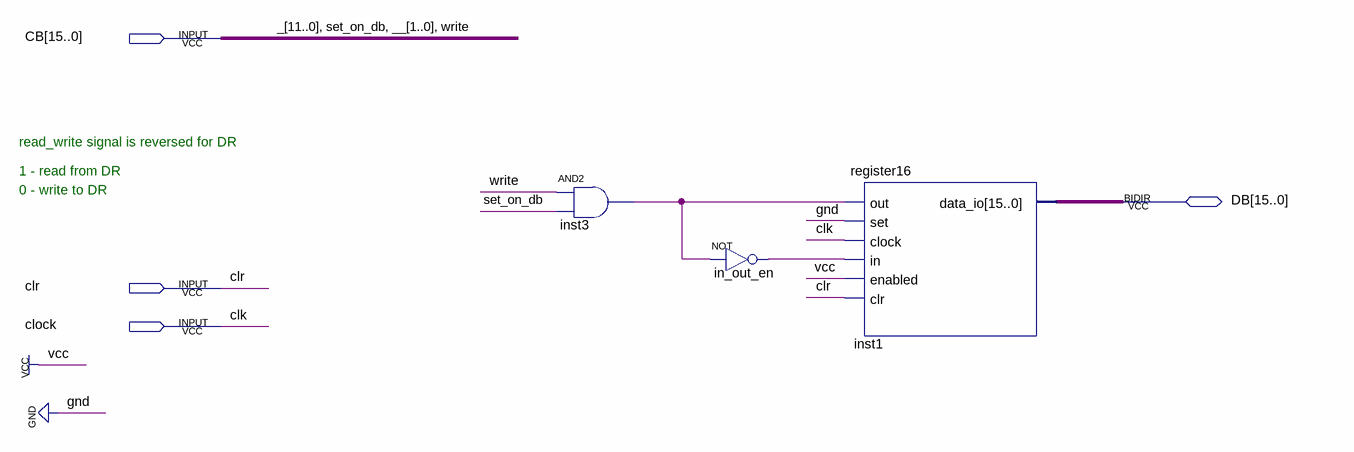
[diagram p0: schematic sheet]
// Quartus schematic data_register.bdf as structural Verilog: 3 symbols, 4 pins
module data_register (
  input  [15:0] CB,
  input  clr,
  input  clock,
  inout  [15:0] DB
);

  wire in_out_en_out, inst3_out;

  and inst3 (inst3_out, CB[0], CB[3]);
  not in_out_en (in_out_en_out, inst3_out);
  register16 inst1 (
    .out(inst3_out), .set(1'b0), .clock(clock), .in(in_out_en_out), .enabled(1'b1), .clr(clr), .data_io(DB));

  // Other names for the same wires on the sheet: _[11:0] = CB[15:4]; __[1:0] = CB[2:1]; clk = clock;
  //   set_on_db = CB[3]; write = CB[0]

  // Notes on the sheet:
  //   read_write signal is reversed for DR
  //   1 - read from DR
  //   0 - write to DR
endmodule
